# Altium project Mechalino_First_Layer.PrjPcb
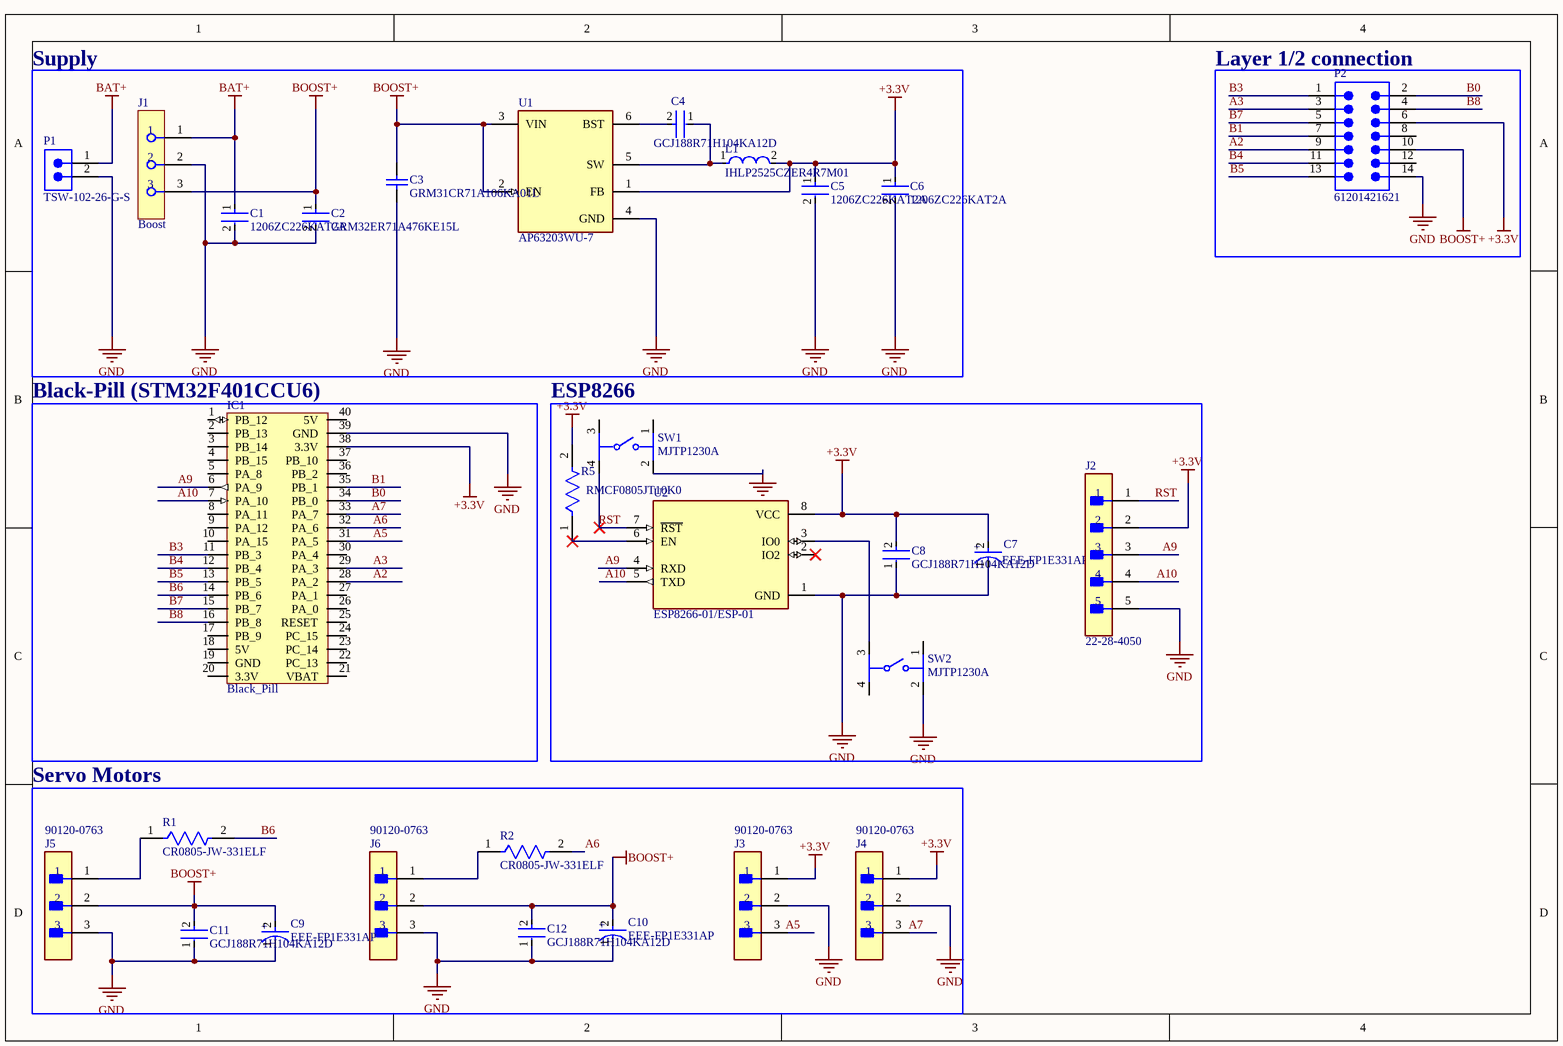
[diagram p0: Mechalino_First_Layer.SchDoc]
2 sheets, 35 parts. Net scope: global (net labels, ports and power ports of the same name join across sheets).
Board files: adsd.PcbDoc, Mechalino_First_Layer.PcbDoc
Sheets:
  Mechalino_First_Layer.SchDoc
  Test.SchDoc

## Sheet Mechalino_First_Layer.SchDoc
size A4; SheetNumber: 1; SheetTotal: 1

### Parts
C1  1206ZC226KAT2A  [FP-1206Q-MFG]
C2  GRM32ER71A476KE15L  [FP-GRM32E-0_3-0_2-IPC_A]
C3  GRM31CR71A106KA01L  [CAPC3216X180X55LL20T25]
C4  GCJ188R71H104KA12D  [FP-GCJ188-0_2-IPC_C]
C5  1206ZC226KAT2A  [FP-1206Q-MFG]
C6  1206ZC226KAT2A  [FP-1206Q-MFG]
C7  EEE-FP1E331AP  [FP-FPF-MFG]
C8  GCJ188R71H104KA12D  [FP-GCJ188-0_2-IPC_C]
C9  EEE-FP1E331AP  [FP-FPF-MFG]
C10  EEE-FP1E331AP  [FP-FPF-MFG]
C11  GCJ188R71H104KA12D  [FP-GCJ188-0_2-IPC_C]
C12  GCJ188R71H104KA12D  [FP-GCJ188-0_2-IPC_C]
IC1  Black_Pill  [Black_Pill_STM32F401CCU6]
J1  Boost  [FP-SSW-103-01-G-S-MFG]
J2  22-28-4050  [FP-22-28-4050-MFG]
J3  90120-0763  [FP-90120-0763-MFG]
J4  90120-0763  [FP-90120-0763-MFG]
J5  90120-0763  [FP-90120-0763-MFG]
J6  90120-0763  [FP-90120-0763-MFG]
L1  IHLP2525CZER4R7M01  [FP-IHLP-2525CZ-FP_2_413x3-MFG]
P1  TSW-102-26-G-S  [SMTC-TSW-102-26-XX-S]
P2  61201421621  [61201421621]
R1  CR0805-JW-331ELF  [FP-CR0805-IPC_B]
R2  CR0805-JW-331ELF  [FP-CR0805-IPC_B]
R5  RMCF0805JT10K0  [FP-RMCF0805-IPC_A]
SW1  MJTP1230A  [FP-MJTP1230A-MFG]
SW2  MJTP1230A  [FP-MJTP1230A-MFG]
U1  AP63203WU-7  [FP-TSOT26-MFG]
U2  ESP8266-01/ESP-01  [XCVR_ESP8266-01/ESP-01]

### Blocks framed on the sheet
Servo Motors: IC1

### Nets
+3.3V: C5.1 C6.1 C7.2(A) C8.2 IC1.38(3.3V) J2.2 J3.1 J4.1 L1.2 P2.6 R5.2 U1.1(FB) U2.8(VCC)
BAT+: C1.1 J1.1 P1.1
BOOST+: C2.1 C3.2 C9.2(A) C10.2(A) C11.2 C12.2 J1.3 J5.2 J6.2 P2.10 U1.2(EN) U1.3(VIN)
GND: C1.2 C2.2 C3.1 C5.2 C6.2 C7.1(C) C8.1 C9.1(C) C10.1(C) C11.1 C12.1 IC1.39(GND) J1.2 J2.5 J3.2 J4.2 J5.3 J6.3 P1.2 P2.14 SW1.2 SW2.2 U1.4(GND) U2.1(GND)
A2: IC1.28(PA_2) P2.9
A3: IC1.29(PA_3) P2.3
A5: IC1.31(PA_5) J3.3
A6: IC1.32(PA_6) R2.2
A7: IC1.33(PA_7) J4.3
A9: IC1.6(PA_9) J2.3 U2.4(RXD)
A10: IC1.7(PA_10) J2.4 U2.5(TXD)
B0: IC1.34(PB_0) P2.2
B1: IC1.35(PB_1) P2.7
B3: IC1.11(PB_3) P2.1
B4: IC1.12(PB_4) P2.11
B5: IC1.13(PB_5) P2.13
B6: IC1.14(PB_6) R1.2
B7: IC1.15(PB_7) P2.5
B8: IC1.16(PB_8) P2.4
RST: J2.1 SW1.4 U2.7(~{RST})
NetC4_1: C4.1 L1.1 U1.5(SW)
NetC4_2: C4.2 U1.6(BST)
NetJ5_1: J5.1 R1.1
NetJ6_1: J6.1 R2.1
NetR5_1: R5.1 U2.6(EN)
NetSW2_3: SW2.3 U2.3(IO0)

Not connected (* = marked no-connect by the designer): IC1 1(PB_12) 2(PB_13) 3(PB_14) 4(PB_15) 5(PA_8) 8(PA_11) 9(PA_12) 10(PA_15) 17(PB_9) 18(5V) 19(GND) 20(3.3V) 21(VBAT) 22(PC_13) 23(PC_14) 24(PC_15) 25(RESET) 26(PA_0) 27(PA_1) 30(PA_4) 36(PB_2) 37(PB_10) 40(5V); P2 8 12; SW1 1 3; SW2 1 4; U2 2(IO2)*

### Notes on the sheet
- Supply
- (near P2) Layer 1/2 connection
- (near IC1) Black-Pill (STM32F401CCU6)
- ESP8266
- (in symbol CMP-05427-000082-1) +

### Library data of the parts
C1 C5 C6 = CMP-04427-000069-1: CAP CER 22UF 10V X7R 1206; Dissipation Factor: 5%; Tolerance: 10%; Depth: 1.6mm; REACH SVHC: No SVHC; Length: 3.2mm; Dielectric: X7R; Voltage Rating (DC): 10V; Width: 0.063inch; Case Code (Metric): 3216; Capacitance: 22uF; Voltage: 10V; Mount: Surface Mount; Voltage Rating: 10V; Termination: SMD/SMT; Min Operating Temperature: -55°C; Series: -; Package Quantity: 2500; Max Operating Temperature: 125°C; Construction: Flat; RoHS Compliant: Yes; Thickness: 0.071inch; Contact Plating: Tin; Case Code (Imperial): 1206; Lead Free: Lead Free; Packaging: Cut Tape; Case/Package: 1206
C2 = CMP-1662-00023-3: Chip Multilayer Ceramic Capacitors for General Purpose, 1210, 47uF, X7R, 15%, 10%, 10V; Voltage Rating: 10V; Case Code (Metric): 3225; REACH SVHC: No SVHC; Depth: 2.5mm; Termination: SMD/SMT; Width: 2.5mm; Number of Pins: 2; Mount: Surface Mount; Case Code (Imperial): 1210; Package Quantity: 1; Thickness: 0.106inch; Height: 2.5mm; Length: 3.2mm; Case/Package: 1210; Packaging: Tape and Reel; Lead Free: Lead Free; Radiation Hardening: No; Dielectric: X7R; Tolerance: 10%; Max Operating Temperature: 125°C; Voltage: 10V; Material: Ceramic; Capacitance: 47uF; Min Operating Temperature: -55°C; Voltage Rating (DC): 10V
C3 = CMP-2000-06349-1: Chip Monolithic Ceramic Capacitor, 10 uF, 10 V, +/- 10%, -55 to 125 degC, 1206 (3216 Metric), RoHS, Tape and Reel; Manufacturer: Murata; Voltage - Rated: 10V; Catalog Drawings: GRMSeries_1206_1.6; Featured Product: GA3SafetyRecognizedCapsandHi-CapMLCC; Online Catalog: GRMSeries; Capacitance: 10µF; Temperature Coefficient: X7R; Other Names: 490-3371-6; Product Training Modules: High-CapMultilayerCeramicCapacitors; Applications: GeneralPurpose; Mounting Technology: SurfaceMount; Operating Temperature: -55°C~125°C; Lead Spacing: -; Package / Case: 1206(3216Metric); Category: Capacitors; Family: CeramicCapacitors; Ratings: -; Tolerance: ±10%; Series: GRM; Thickness (Max): 0.071"(1.80mm); Package Reference: 1206; Size / Dimension: 0.126"Lx0.063"W(3.20mmx1.60mm); Packaging: Digi-Reel®; Datasheet URL: http://search.murata.co.jp/Ceramy/image/img/A01X/G101/ENG/GRM31CR71A106KA01-01.pdf; Mounting Type: SurfaceMount,MLCC; Features: -; Standard Package: 1; Package Description: 2-Pin Surface Mount Device, Body 3.2 x 1.6 mm; Datasheet Version: 02/2016; Lead Style: -; Manufacturer URL: http://www.murata.com/; Height - Seated (Max): -
C4 C8 C11 C12 = CMP-2006-02223-2: Cap Ceramic 0.1uF 50V X7R 10% Pad SMD 0603 Soft Termination +125°C Automotive T/R; Capacitance: 100nF; Radiation Hardening: No; Dielectric: X7R; Voltage Rating (DC): 50V; Case Code (Imperial): 0603; Length: 1.6mm; Features: Soft Termination; Case Code (Metric): 1608; Case/Package: 0603; Termination: SMD/SMT; Packaging: Tape and Reel; Height: 0.8mm; Tolerance: 10%; Thickness: 0.035inch; Width: 0.031inch; Voltage Rating: 50V; Min Operating Temperature: -55°C; Ratings: AEC-Q200; Package Quantity: 1; Depth: 0.8mm; Mount: Surface Mount; Lead Free: Lead Free; Max Operating Temperature: 125°C
C7 C9 C10 = CMP-05427-000082-1: CAP ALUM 330UF 20% 25V SMD; Dielectric Material: Aluminium; Ripple Current (AC): 850mA; Life (Hours): 2000Hour; ESR (Equivalent Series Resistance): 80mR; Leakage Current: 82.5uA; Package Quantity: 500; Height - Seated (Max): 0.402inch; Capacitance: 330uF; Max Operating Temperature: 105°C; Diameter: 8mm; Width: 8.3mm; Packaging: Tape and Reel; Radiation Hardening: No; Lead Pitch: 3.1mm; REACH SVHC: No SVHC; Contact Plating: Tin; Series: FP; Termination: SMD/SMT; RoHS Compliant: Yes; Material: Aluminium; Voltage Rating (DC): 25V; Voltage Rating: 25V; Min Operating Temperature: -55°C; Construction: Cylindrical; Length: 10.5mm; Number of Pins: 2; Case/Package: Radial; Voltage: 25V; Height: 10.2mm; Mount: Surface Mount; Tolerance: 20%; Lead Free: Lead Free; Ripple Current: 850mA
IC1 = Black_Pill: STM32F401CCU6
J1 = CMP-00575-00296058-1: SSW-103-01-G-S SSW - Samtec 2.54mm Single Row Straight Socket Strip 8.5 Profile (mcv)(TO22); Manufacturer Lifecycle Status: PRODUCTION; Lead Length: 2.64mm; Voltage Rating (AC): 465V; Max Current Rating: 6.9A; Current Rating: 4.7A; Number of Contacts: 3; Voltage Rating (DC): 655V; Connector Type: Receptacle, Socket; Contact Resistance: 10mΩ; Max Voltage Rating (AC): 550V; Gender: Receptacle; Color: Black; Termination: Solder; Lead Pitch: 2.54mm; Mount: Through Hole; Contact Plating: Gold; Housing Color: Black; Pitch: 2.54mm; Depth: 2.41mm; Radiation Hardening: No; Number of Rows: 1; REACH SVHC: No SVHC; Number of Positions: 3; Height: 8.64mm; Lead Free: Lead Free; Length: 8.13mm; Contact Material: Gold, Nickel; Orientation: Straight; Voltage Rating: 655V; Max Operating Temperature: 125°C; Lifecycle Status: Production; Min Operating Temperature: -55°C; RoHS: Compliant
J2 = CMP-00257-00278173-1: 22-28-4050 KK® 254 Breakaway Header, Vertical, 5 Circuits, Tin (Sn) Plating, Mating Pin Length 6.09mm; NexarPartId: 278173; Voltage Rating: 250V; Number of Contacts: 5; Contact Resistance: 20mΩ; Gender: Male; Pitch: 2.54mm; Connector Type: Male Pin; Current Rating: 4A; Glow Wire Compliant: Non-compliant; Max Voltage Rating (DC): 250.25kV; Flammability Rating: UL94 V-0; Min Operating Temperature: 0°C; REACH SVHC: Unknown; Lead Free: Lead Free; Termination: Solder; RoHS: Compliant; Schedule B: 8536694040; Number of Circuits: 5; Mount: Through Hole; Lead Pitch: 2.54mm; Height: 2.29mm; Voltage Rating (DC): 250V; Max Operating Temperature: 75°C; Width: 2.49mm; Radiation Hardening: No; Contact Plating: Tin; Orientation: Vertical; Length: 12.7mm; Number of Rows: 1; Housing Material: Thermoplastic; Contact Material: Brass; Packaging: Bulk; Contact Mating Length: 6.096mm; Housing Color: Black; Color: Black; Number of Positions: 5
J3-J6 = CMP-04776-000084-1: CONN HEADER VERT 3POS 2.54MM; Manufacturer: Molex; Voltage Rating: 350V; Number Of Contacts: 3; Conn Orientation: Vertical; Current Rating: 3A; Conn Gender: Male; Description: Board-To-Board Connector, C-Grid III 90120 Series, Through Hole, Header, 3, 2.54 mm; Package: 90120-0763; ComponentLink2Description: Datasheet; Height: 5.8mm; Manufacturer Part Number: 90120-0763; Temperature Range High: +125°C; RoHS: TRUE; ComponentLink2URL: https://www.molex.com/webdocs/datasheets/pdf/en-us/0901200763_PCB_HEADERS.pdf; Device Class L2: Headers and Wire Housings; Temperature: -55°C to +125°C; Device Class L1: Connectors; Pitch: 2.54mm; Footprint Url: https://www.molex.com/pdm_docs/sd/901200763_sd.pdf; Device Class L3: unset; Temperature Range Low: -55°C; Number Of Rows: 1; Category: Conn; Lead Free: Yes; Mouser Description: Board-To-Board Connector, C-Grid III 90120 Series, Through Hole, Header, 3, 2.54 mm; Octopart: https://octopart.com/90120-0763-molex-655433; Contact Material: Gold,Nickel; Automotive: No; Digikey Description: CONN HEADER VERT 3POS 2.54MM
L1 = CMP-02424-000538-1: Commercial Inductors, High Saturation Series 4.7uH 5.5A 40mΩ 20%; DC Resistance (DCR): 40mR; Max DC Current: 10A; Shielding: Shielded; Test Frequency: 100kHz; Self Resonant Frequency: 5MHz; Core Material: Metal; Height: 3mm; Depth: 6.72mm; Inductance Tolerance: 20%; Inductance: 4.7uH; Number of Pins: 2; Military Standard: Not; Min Operating Temperature: -55°C; Mount: Surface Mount; Saturation Current: 10A; Case/Package: 2525; Case Code (Metric): 6363; Packaging: Tape and Reel; Width: 0.255inch; Current Rating: 5.5A; Package Quantity: 2000; Termination: SMD/SMT; Case Code (Imperial): 2525; Lead Free: Lead Free; Contact Plating: Tin; Max Operating Temperature: 125°C; Tolerance: 20%; Length: 7.24mm; Radiation Hardening: No; Height - Seated (Max): 0.118inch; RMS Current (Irms): 5.5A
P1 = CMP-1024-00327-1: 0.025" SQ Post Header, Through-hole, Vertical, -55 to 125 degC, 2.54 mm Pitch, 2-Pin, Male, RoHS; Manufacturer: Samtec; Pitch: 2.54 mm; Orientation: Vertical; ComponentLink3Description: Package Specification; PackageReference: TSW-102-26-XX-S; Mounting Technology: Through-hole; ComponentLink2Description: Datasheet; ComponentLink1URL: http://www.samtec.com; DatasheetVersion: F-214; ComponentLink1Description: Manufacturer URL; RoHS: True; ComponentLink2URL: http://www.samtec.com/documents/webfiles/pdf/TSW_TH.PDF; PartNumber: TSW-102-26-G-S; ComponentLink3URL: http://www.samtec.com/documents/webfiles/cpdf/TSW-XXX-XX-XXX-X-XX-XXX-MKT.pdf; PackageDescription: .025[0.64] SQ. Post Terminal Strip Assembly; PackageVersion: DM, 8/1988; Temperature Range: -55 to 125 degC
P2 = CMP-1502-00008-2: NexarPartId: 26603596; Number of Positions: 14; Connector Type: Male Pin; Voltage Rating: 250V; Insulation Resistance: 1GΩ; Gender: Male; Contact Resistance: 20mΩ; Pitch: 2.54mm; Current Rating: 3A; Insulation Material: PBT; Mount: Through Hole; Number of Rows: 2; Contact Material: Copper; Operating Supply Voltage: 250V; Number of Pins: 14; Min Operating Temperature: -40°C; RoHS: Compliant; REACH SVHC: Unknown; Length: 25.44mm; Contact Plating: Gold; Termination: Solder; Lead Pitch: 2.54mm; Max Operating Temperature: 105°C; Row Spacing: 2.54mm; Height: 9.25mm; Color: Black; Number of Contacts: 14; Orientation: Vertical
R1 R2 = CMP-07231-005909-1: Thick Film Chip Resistors 0805 330Ω 0.125W 5% 200ppm/°C; Voltage Rating (DC): 150V; Max Power Dissipation: 125mW; Resistance: 330R; Min Operating Temperature: -55°C; Number of Terminations: 2; Width: 0.049inch; Number of Pins: 2; REACH SVHC: No SVHC; Contact Plating: Tin; Max Operating Temperature: 155°C; Mount: Surface Mount; Case Code (Metric): 2012; Length: 2mm; Package Quantity: 1; Tolerance: 5%; Composition: Thick Film; Packaging: Tape and Reel; Case Code (Imperial): 0805; Radiation Hardening: No; Height: 0.024inch; Thickness: 508um; Case/Package: 0805; Termination: SMD/SMT; Voltage Rating: 150V; Power Rating: 125mW; Depth: 1.25mm; Temperature Coefficient: 200ppm/°C; Features: Moisture Resistant; Military Standard: Not
R5 = CMP-26527-002663-1: 10kΩ ±5% 0.125W 0805 Thick Film Chip Resistor AEC-Q200 compliant; Resistance: 10kR; Max Power Dissipation: 125mW; Temperature Coefficient: 100ppm/°C; Construction: Rectangular; RoHS Compliant: Yes; Resistor Type: Thick Film; Series: RMCF; Features: Automotive AEC-Q200; Case Code (Imperial): 0805; Mount: Surface Mount; Min Operating Temperature: -55°C; Military Standard: Not; Tolerance: 5%; Size Code: 0805; Contact Plating: Tin; Length: 2mm; Depth: 1.25mm; Case Code (Metric): 2012; Packaging: Tape and Reel; Radiation Hardening: No; Height: 0.026inch; Case/Package: 0805; Width: 0.049inch; Lead Free: Lead Free; Max Operating Temperature: 155°C; Number of Terminations: 2; Power Rating: 125mW
SW1 SW2 = CMP-47024-000004-1: SWITCH TACTILE SPST-NO 0.05A 12V; Mechanical Life: 100000Cycles; Throw Configuration: SPST; Actuator Length: 1.4mm; Switch Travel: 0.25mm; Actuator Color: Black; Operating Force: 160gf; Contact Resistance: 100mR; Actuator Type: Standard; Switch Function: Off-Mom; Actuator Material: Thermoplastic; Illumination Type: Non-Illuminated; Current Rating: 50mA; Min Operating Temperature: -20°C; Series: MJTP; Electrical Life: 100000Cycles; Mount: Through Hole; Packaging: Bulk; Color: Black; Package Quantity: 2000; Voltage Rating (DC): 12V; REACH SVHC: No SVHC; Orientation: Straight; Termination: PC Pin; Contact Material: Bronze; RoHS Compliant: Yes; Max Voltage Rating (DC): 12V; Max Operating Temperature: 70°C; Contact Plating: Silver
U1 = CMP-12757-000006-1: IC REG BUCK 3.3V 2A TSOT26; Manufacturer: Diodes Inc.; Output Type: Fixed; Min Supply Voltage: 3.8V; Number Of Outputs: 1; Max Junction Temp: +160°C; Nominal Supply Current: 22uA; Standoff Height: 0.01mm; Switching Frequency: 1.1MHz; Max Supply Voltage: 32V; Description: Buck Switching Regulator IC Positive Fixed 3.3V 1 Output 2A SOT-23-6 Thin, TSOT-23-6; ComponentLink2Description: Datasheet; Device Class L1: Integrated Circuits (ICs); Temperature: to +160°C; Device Class L3: Voltage Regulators - Switching; RoHS: TRUE; Octopart: https://octopart.com/ap63203wu-7-diodes+inc.-98099550; Output Voltage: 3.3V; Lead Free: Yes; ComponentLink2URL: https://www.diodes.com/assets/Datasheets/AP63200-AP63201-AP63203-AP63205.pdf; Digikey Description: IC REG BUCK 3.3V 2A TSOT26; Footprint Url: https://www.diodes.com/assets/Package-Files/TSOT26.pdf; Ambient Temperature Range High: +85°C; Height: 1mm; Automotive: No; Temperature Range High: +160°C; Switching Topology: Buck; Output Current: 2A; Package: TSOT26; Category: IC; Mouser Description: AP63203 Series 3.3 V 2 A SMT Fixed Low IQ Synchronous Buck - TSOT-26; Device Class L2: Power Management ICs; Ambient Temperature Range Low: -40°C; Manufacturer Part Number: AP63203WU-7
U2 = ESP8266-01/ESP-01: MakerFocus 4pcs ESP8266 ESP-01 Serial Wireless WiFi Transceiver Receiver Module 1MB SPI Flash DC3.0-3.6V Internet of Things WiFi Module Board Compatible with Ar duino; Value: *; MP: ESP8266-01/ESP-01; Package: None; Availability: Unavailable; Price: None

## Sheet Test.SchDoc
size A4; SheetNumber: 2; SheetTotal: 2
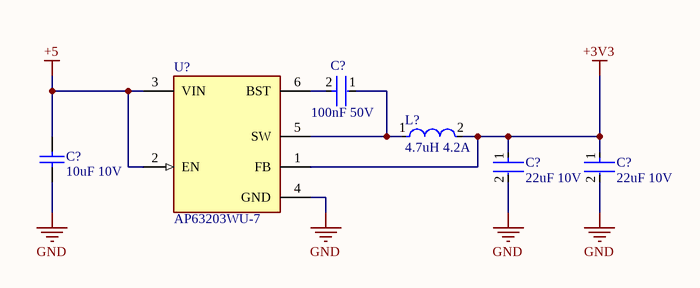
[diagram p1: Test.SchDoc]

### Parts
(Parts that share a designator on the sheet are numbered #1, #2 ... from top to bottom, then left to right.)
C?#1  100nF 50V  [FP-GCJ188-0_2-IPC_C]
C?#2  22uF 10V  [FP-1206Q-MFG]
C?#3  22uF 10V  [FP-1206Q-MFG]
C?#4  10uF 10V  [CAPC3216X180X55LL20T25]
L?  4.7uH 4.2A  [FP-IHLP-2525CZ-FP_2_413x3-MFG]
U?  AP63203WU-7  [FP-TSOT26-MFG]

### Nets
+3V3: C?#2.1 C?#3.1 L?.2 U?.1(FB)
+5: C?#4.2 U?.2(EN) U?.3(VIN)
GND: C?#2.2 C?#3.2 C?#4.1 U?.4(GND)
NetC?#1_1: C?#1.1 L?.1 U?.5(SW)
NetC?#1_2: C?#1.2 U?.6(BST)

### Library data of the parts
C?#1 = CMP-2006-02223-2: Cap Ceramic 0.1uF 50V X7R 10% Pad SMD 0603 Soft Termination +125°C Automotive T/R; Radiation Hardening: No; Dielectric: X7R; Voltage Rating (DC): 50V; Case Code (Imperial): 0603; Length: 1.6mm; Features: Soft Termination; Case Code (Metric): 1608; Case/Package: 0603; Termination: SMD/SMT; Packaging: Tape and Reel; Height: 0.8mm; Tolerance: 10%; Thickness: 0.035inch; Width: 0.031inch; Voltage Rating: 50V; Min Operating Temperature: -55°C; Ratings: AEC-Q200; Package Quantity: 1; Capacitance: 100nF; Depth: 0.8mm; Mount: Surface Mount; Lead Free: Lead Free; Max Operating Temperature: 125°C
C?#2 C?#3 = CMP-04427-000069-1: as C1 on sheet Mechalino_First_Layer; Depth: 1.6mm; REACH SVHC: No SVHC; Length: 3.2mm; Dielectric: X7R; Voltage Rating (DC): 10V; Width: 0.063inch; Case Code (Metric): 3216; Capacitance: 22uF; Voltage: 10V; Mount: Surface Mount; Voltage Rating: 10V; Termination: SMD/SMT; Min Operating Temperature: -55°C; Series: -; Package Quantity: 2500; Max Operating Temperature: 125°C; Construction: Flat; RoHS Compliant: Yes; Thickness: 0.071inch; Contact Plating: Tin; Case Code (Imperial): 1206; Lead Free: Lead Free; Packaging: Cut Tape; Case/Package: 1206
C?#4 = CMP-2000-06349-1: Chip Monolithic Ceramic Capacitor, 10 uF, 10 V, +/- 10%, -55 to 125 degC, 1206 (3216 Metric), RoHS, Tape and Reel; Manufacturer: Murata; Catalog Drawings: GRMSeries_1206_1.6; Featured Product: GA3SafetyRecognizedCapsandHi-CapMLCC; Online Catalog: GRMSeries; Capacitance: 10µF; Temperature Coefficient: X7R; Other Names: 490-3371-6; Product Training Modules: High-CapMultilayerCeramicCapacitors; Voltage - Rated: 10V; Applications: GeneralPurpose; Mounting Technology: SurfaceMount; Operating Temperature: -55°C~125°C; Lead Spacing: -; Package / Case: 1206(3216Metric); Category: Capacitors; Family: CeramicCapacitors; Ratings: -; Tolerance: ±10%; Series: GRM; Thickness (Max): 0.071"(1.80mm); Package Reference: 1206; Size / Dimension: 0.126"Lx0.063"W(3.20mmx1.60mm); Packaging: Digi-Reel®; Datasheet URL: http://search.murata.co.jp/Ceramy/image/img/A01X/G101/ENG/GRM31CR71A106KA01-01.pdf; Mounting Type: SurfaceMount,MLCC; Features: -; Standard Package: 1; Package Description: 2-Pin Surface Mount Device, Body 3.2 x 1.6 mm; Datasheet Version: 02/2016; Lead Style: -; Manufacturer URL: http://www.murata.com/; Height - Seated (Max): -
L? = CMP-02424-000538-1: as L1 on sheet Mechalino_First_Layer; Height: 3mm; Depth: 6.72mm; Inductance Tolerance: 20%; Inductance: 4.7uH; Number of Pins: 2; Military Standard: Not; Min Operating Temperature: -55°C; Mount: Surface Mount; Saturation Current: 10A; Case/Package: 2525; Case Code (Metric): 6363; Packaging: Tape and Reel; Width: 0.255inch; Current Rating: 5.5A; Package Quantity: 2000; Termination: SMD/SMT; Case Code (Imperial): 2525; Lead Free: Lead Free; Contact Plating: Tin; Max Operating Temperature: 125°C; Tolerance: 20%; Length: 7.24mm; Radiation Hardening: No; Height - Seated (Max): 0.118inch; RMS Current (Irms): 5.5A
U? = CMP-12757-000006-1: IC REG BUCK 3.3V 2A TSOT26; Manufacturer: Diodes Inc.; Description: Buck Switching Regulator IC Positive Fixed 3.3V 1 Output 2A SOT-23-6 Thin, TSOT-23-6; Output Type: Fixed; Min Supply Voltage: 3.8V; Number Of Outputs: 1; Max Junction Temp: +160°C; Nominal Supply Current: 22uA; Standoff Height: 0.01mm; Switching Frequency: 1.1MHz; Max Supply Voltage: 32V; ComponentLink2Description: Datasheet; Device Class L1: Integrated Circuits (ICs); Temperature: to +160°C; Device Class L3: Voltage Regulators - Switching; RoHS: TRUE; Octopart: https://octopart.com/ap63203wu-7-diodes+inc.-98099550; Output Voltage: 3.3V; Lead Free: Yes; ComponentLink2URL: https://www.diodes.com/assets/Datasheets/AP63200-AP63201-AP63203-AP63205.pdf; Digikey Description: IC REG BUCK 3.3V 2A TSOT26; Footprint Url: https://www.diodes.com/assets/Package-Files/TSOT26.pdf; Ambient Temperature Range High: +85°C; Height: 1mm; Automotive: No; Temperature Range High: +160°C; Switching Topology: Buck; Output Current: 2A; Package: TSOT26; Category: IC; Mouser Description: AP63203 Series 3.3 V 2 A SMT Fixed Low IQ Synchronous Buck - TSOT-26; Device Class L2: Power Management ICs; Ambient Temperature Range Low: -40°C; Manufacturer Part Number: AP63203WU-7

## Nets that join several sheets
GND: Mechalino_First_Layer (24 pins), Test (C?#2.2 C?#3.2 C?#4.1 U?.4)